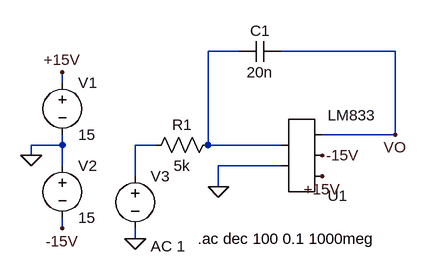
[diagram p0: schematic Integrador.asc]
Integrador.asc, the LTspice schematic file:
Version 4
SHEET 1 880 680
WIRE 144 -64 96 -64
WIRE 384 -64 208 -64
WIRE -128 -16 -128 -32
WIRE 384 64 384 -64
WIRE 384 64 272 64
WIRE -128 80 -128 64
WIRE -128 80 -176 80
WIRE 16 80 -16 80
WIRE 96 80 96 -64
WIRE 208 80 96 80
WIRE -176 96 -176 80
WIRE -128 112 -128 80
WIRE 208 112 112 112
WIRE -16 128 -16 80
WIRE 112 144 112 112
WIRE -128 208 -128 192
WIRE -16 224 -16 208
FLAG -176 96 0
FLAG -128 -32 +15V
FLAG -128 208 -15V
FLAG 112 144 0
FLAG -16 224 0
FLAG 384 64 VO
FLAG 272 128 +15V
FLAG 272 96 -15V
SYMBOL voltage -128 -32 R0
WINDOW 123 0 0 Left 0
WINDOW 39 0 0 Left 0
SYMATTR InstName V1
SYMATTR Value 15
SYMBOL voltage -128 96 R0
WINDOW 123 0 0 Left 0
WINDOW 39 0 0 Left 0
SYMATTR InstName V2
SYMATTR Value 15
SYMBOL voltage -16 112 R0
WINDOW 123 24 124 Left 2
WINDOW 39 0 0 Left 0
SYMATTR Value2 AC 1
SYMATTR InstName V3
SYMATTR Value ""
SYMBOL AutoGenerated\\LM833 240 96 M180
SYMATTR InstName U1
SYMBOL cap 208 -80 R90
WINDOW 0 0 32 VBottom 2
WINDOW 3 32 32 VTop 2
SYMATTR InstName C1
SYMATTR Value 20n
SYMBOL res 112 64 R90
WINDOW 0 0 56 VBottom 2
WINDOW 3 32 56 VTop 2
SYMATTR InstName R1
SYMATTR Value 5k
TEXT 80 224 Left 2 !.ac dec 100 0.1 1000meg

The netlist it stands for:
* Integrador.asc
V1 +15V 0 15
V2 0 -15V 15
V3 N002 0 AC 1
* U1: LM833 (symbol AutoGenerated\LM833 not available, pins judged from their places): pin1=0 pin2=N001 pin3=+15V pin4=-15V pin5=VO
C1 VO N001 20n
R1 N001 N002 5k
.ac dec 100 0.1 1000meg
.backanno
.end